# Altium schematic sheet RF_filter.SchDoc
size A4; SheetNumber: 4; SheetTotal: 6
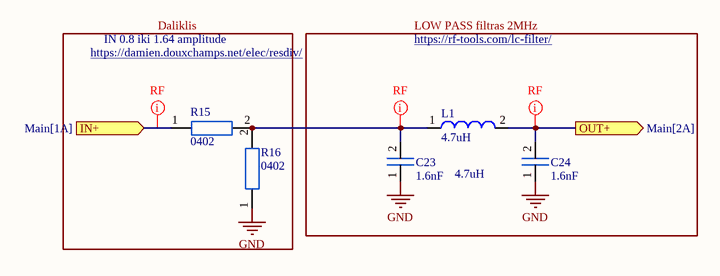
[diagram p0: RF_filter.SchDoc]

## Parts
C23  1.6nF  [0402_footprint]
C24  1.6nF  [0402_footprint]
L1  4.7uH  [0603_FOOTPRINT]
R15  0402  [0402_footprint]
R16  0402  [0402_footprint]

## Ports
IN+ (in, see Main[1A]), OUT+ (out, see Main[2A])

## Nets
GND: C23.1 C24.1 R16.1
IN+: R15.1 ; port IN+
OUT+: C24.2 L1.2 ; port OUT+
NetC23_2: C23.2 L1.1 R15.2 R16.2

## Layout directives
net class RF: IN+, NetC23_2, OUT+

## Notes on the sheet
- https://damien.douxchamps.net/elec/resdiv/
- IN 0.8 iki 1.64 amplitude
- Daliklis
- LOW PASS filtras 2MHz
- https://rf-tools.com/lc-filter/
- 4.7uH

## Library data of the parts
C23 C24 = Capacitor_0402: 0402 capacitor
L1 = Inductor_0603: 0603 inductor
R15 R16 = Resistor_0402